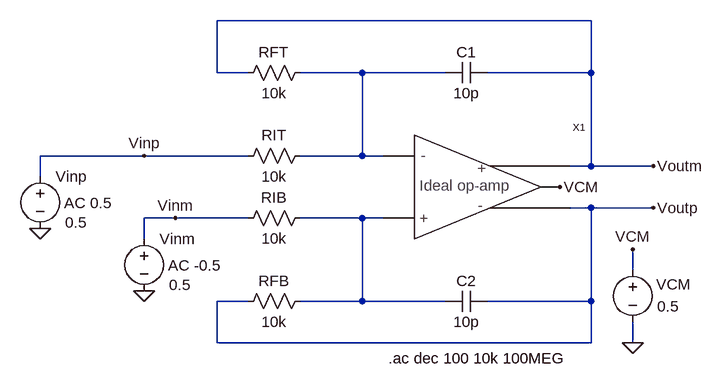
[diagram p0: schematic _Fig3_5_MSD.asc]
_Fig3_5_MSD.asc, the LTspice schematic file:
Version 4
SHEET 1 2748 704
WIRE 1472 -656 896 -656
WIRE 896 -576 896 -656
WIRE 944 -576 896 -576
WIRE 1120 -576 1024 -576
WIRE 1248 -576 1120 -576
WIRE 1472 -576 1472 -656
WIRE 1472 -576 1312 -576
WIRE 784 -448 624 -448
WIRE 944 -448 784 -448
WIRE 1120 -448 1120 -576
WIRE 1120 -448 1024 -448
WIRE 1152 -448 1120 -448
WIRE 1472 -432 1472 -576
WIRE 1472 -432 1440 -432
WIRE 1568 -432 1472 -432
WIRE 624 -416 624 -448
WIRE 1472 -368 1440 -368
WIRE 1568 -368 1472 -368
WIRE 832 -352 784 -352
WIRE 944 -352 832 -352
WIRE 1120 -352 1024 -352
WIRE 1152 -352 1120 -352
WIRE 784 -320 784 -352
WIRE 1536 -272 1536 -304
WIRE 944 -224 896 -224
WIRE 1120 -224 1120 -352
WIRE 1120 -224 1024 -224
WIRE 1248 -224 1120 -224
WIRE 1472 -224 1472 -368
WIRE 1472 -224 1312 -224
WIRE 896 -160 896 -224
WIRE 1472 -160 1472 -224
WIRE 1472 -160 896 -160
WIRE 1536 -160 1536 -192
FLAG 1536 -160 0
FLAG 1536 -304 VCM
FLAG 1424 -400 VCM
FLAG 1568 -432 Voutm
FLAG 1568 -368 Voutp
FLAG 624 -336 0
FLAG 784 -448 Vinp
FLAG 832 -352 Vinm
FLAG 784 -240 0
SYMBOL Ideal_differential_op_amp 1200 -400 R0
SYMATTR InstName X1
SYMBOL voltage 1536 -288 R0
WINDOW 0 36 38 Left 0
WINDOW 3 38 72 Left 0
SYMATTR InstName VCM
SYMATTR Value 0.5
SYMBOL cap 1312 -592 R90
WINDOW 0 0 32 VBottom 0
WINDOW 3 32 32 VTop 0
SYMATTR InstName C1
SYMATTR Value 10p
SYMBOL cap 1312 -240 R90
WINDOW 0 0 32 VBottom 0
WINDOW 3 32 32 VTop 0
SYMATTR InstName C2
SYMATTR Value 10p
SYMBOL res 1040 -592 R90
WINDOW 0 0 56 VBottom 0
WINDOW 3 32 56 VTop 0
SYMATTR InstName RFT
SYMATTR Value 10k
SYMBOL res 1040 -464 R90
WINDOW 0 0 56 VBottom 0
WINDOW 3 32 56 VTop 0
SYMATTR InstName RIT
SYMATTR Value 10k
SYMBOL res 1040 -368 R90
WINDOW 0 0 56 VBottom 0
WINDOW 3 32 56 VTop 0
SYMATTR InstName RIB
SYMATTR Value 10k
SYMBOL res 1040 -240 R90
WINDOW 0 0 56 VBottom 0
WINDOW 3 32 56 VTop 0
SYMATTR InstName RFB
SYMATTR Value 10k
SYMBOL voltage 624 -432 R0
WINDOW 3 38 87 Left 0
WINDOW 123 37 57 Left 0
WINDOW 39 0 0 Left 0
SYMATTR Value 0.5
SYMATTR Value2 AC 0.5
SYMATTR InstName Vinp
SYMBOL voltage 784 -336 R0
WINDOW 3 38 87 Left 0
WINDOW 123 37 57 Left 0
WINDOW 39 0 0 Left 0
SYMATTR Value 0.5
SYMATTR Value2 AC -0.5
SYMATTR InstName Vinm
TEXT 1160 -136 Left 0 !.ac dec 100 10k 100MEG

The netlist it stands for:
* _Fig3_5_MSD.asc
XX1 N001 N002 Voutm VCM Voutp Ideal_differential_op_amp  ; pins Vinm Vinp Outp VCM Outm
VCM VCM 0 0.5
C1 Voutm N001 10p
C2 Voutp N002 10p
RFT N001 Voutm 10k
RIT N001 Vinp 10k
RIB N002 Vinm 10k
RFB N002 Voutp 10k
Vinp Vinp 0 0.5 AC 0.5
Vinm Vinm 0 0.5 AC -0.5
.ac dec 100 10k 100MEG
.backanno
.end